# Altium schematic sheet serial and ethernet.schdoc
size A3; Organization: Altium Limited; Address1: L3, 12a Rodborough Rd; Address2: Frenchs Forest; Address3: NSW; Address4: Australia 2086
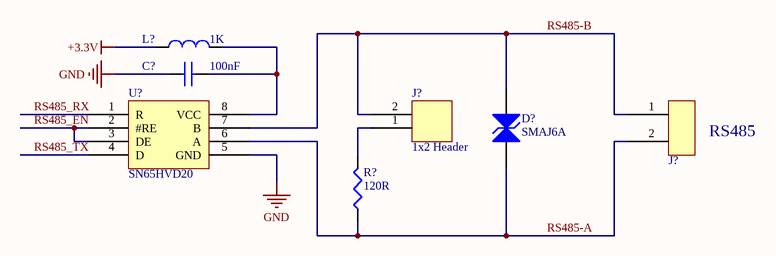
[diagram p0: serial and ethernet.schdoc]

## Parts
(Parts that share a designator on the sheet are numbered #1, #2 ... from top to bottom, then left to right.)
C?  value 100nF  [0805 SMD Ceramic Capacitor]  (hidden comment: C0805C104)
D?  SMAJ6A  [SMA]
J?#1  2x Terminal  [2x Terminal mini]  (value not drawn)
J?#2  value 1x2 Header  [1x2 2 Pin Header]  (hidden comment: 1x2 2 Pin Header)
L?  value 1K  [0805 Inductor]  (hidden comment: 0805Ferrite)
R?  value 120R  [0805 Resistor]  (hidden comment: 0805_120R)
U?  SN65HVD20  [SO8]

## Nets
+3.3V: L?.1
GND: C?.1 U?.5(GND)
RS485-A: D?.1(A) J?#1.2 R?.1 U?.6(A)
RS485-B: D?.2(K) J?#1.1 J?#2.2 U?.7(B)
RS485_EN: U?.2(#RE) U?.3(DE)
RS485_RX: U?.1(R)
RS485_TX: U?.4(D)
NetC?_2: C?.2 L?.2 U?.8(VCC)
NetJ?#2_1: J?#2.1 R?.2

## Notes on the sheet
- (near J?#1) RS485
- Title
- Size:
- Date:
- A3
- Number:
- Time:
- Revision:
- Sheet
- of
- File:

## Library data of the parts
C? = C0805C104: Manufacturer Code: C0805C104J5RACTU; Manufacturer: KEMET; Voltage: 50V; Farnell Code: 1414663; Unit Price: 0,06 €; Package: 0805
D? = SMAJ6A: Manufacturer: MULTICOMP; Manufacturer Code: SMAJ6.0A; Voltage: 6V; Farnell Code: 1579007; Unit Price: 0,24 €; Value: SMAJ6A
J?#1 = 2x Terminal: Manufacturer: WEIDMULLER; Manufacturer Code: PM5.08/2/90 BLK; Value: 2x Terminal; Farnell Code: 1131855; Unit Price: 0,55 €
L? = 0805Ferrite: Manufacturer Code: MMZ2012R102A; Manufacturer: TDK; Current: 500mA; Farnell Code: 1669719; Unit Price: 0,059 €
R? = 0805_120R: Manufacturer Code: MC 0.1W 0805 1% 120R; Manufacturer: MULTICOMP; Tolerance: ±1%; Farnell Code: 9332480; Unit Price: 0,03 €
U? = SN65HVD20: Manufacturer: Texas Instruments; Manufacturer Code: SN65HVD20D; Unit Price: 3,56 €; Farnell Code: 1212361; Value: SN65HVD20